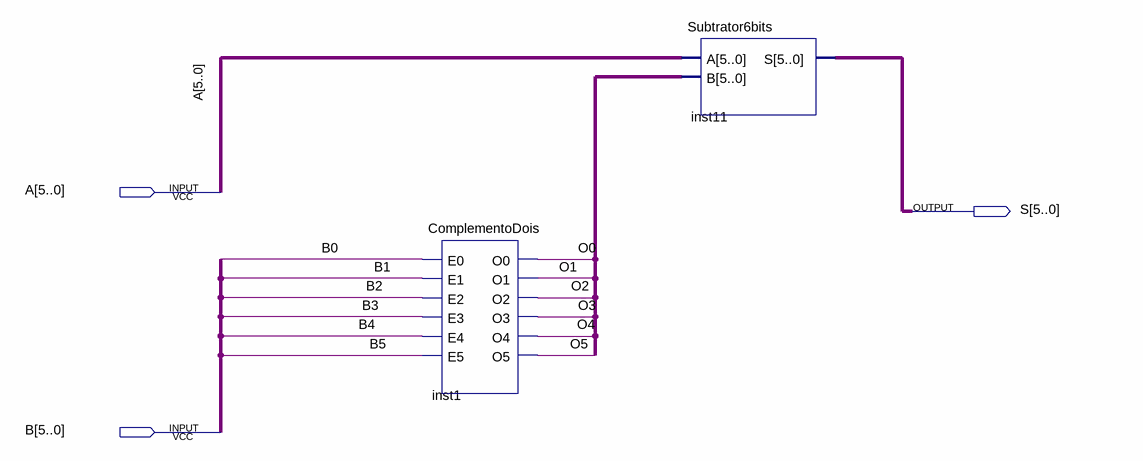
[diagram p0: schematic sheet]
// Quartus schematic Subtrator.bdf as structural Verilog: 2 symbols, 3 pins
module Subtrator (
  input  [5:0] A,
  input  [5:0] B,
  output [5:0] S
);

  wire O0, O1, O2, O3, O4, O5;
  wire [5:0] undriven;

  ComplementoDois inst1 (
    .E0(B[0]), .E1(B[1]), .E2(B[2]), .E3(B[3]), .E4(B[4]), .E5(B[5]), .O0(O0), .O1(O1), .O2(O2), .O3(O3),
    .O4(O4), .O5(O5));
  Subtrator6bits inst11 (.A(A), .B(undriven), .S(S));
endmodule
